# EAGLE schematic main (EAGLE 9.5.2)
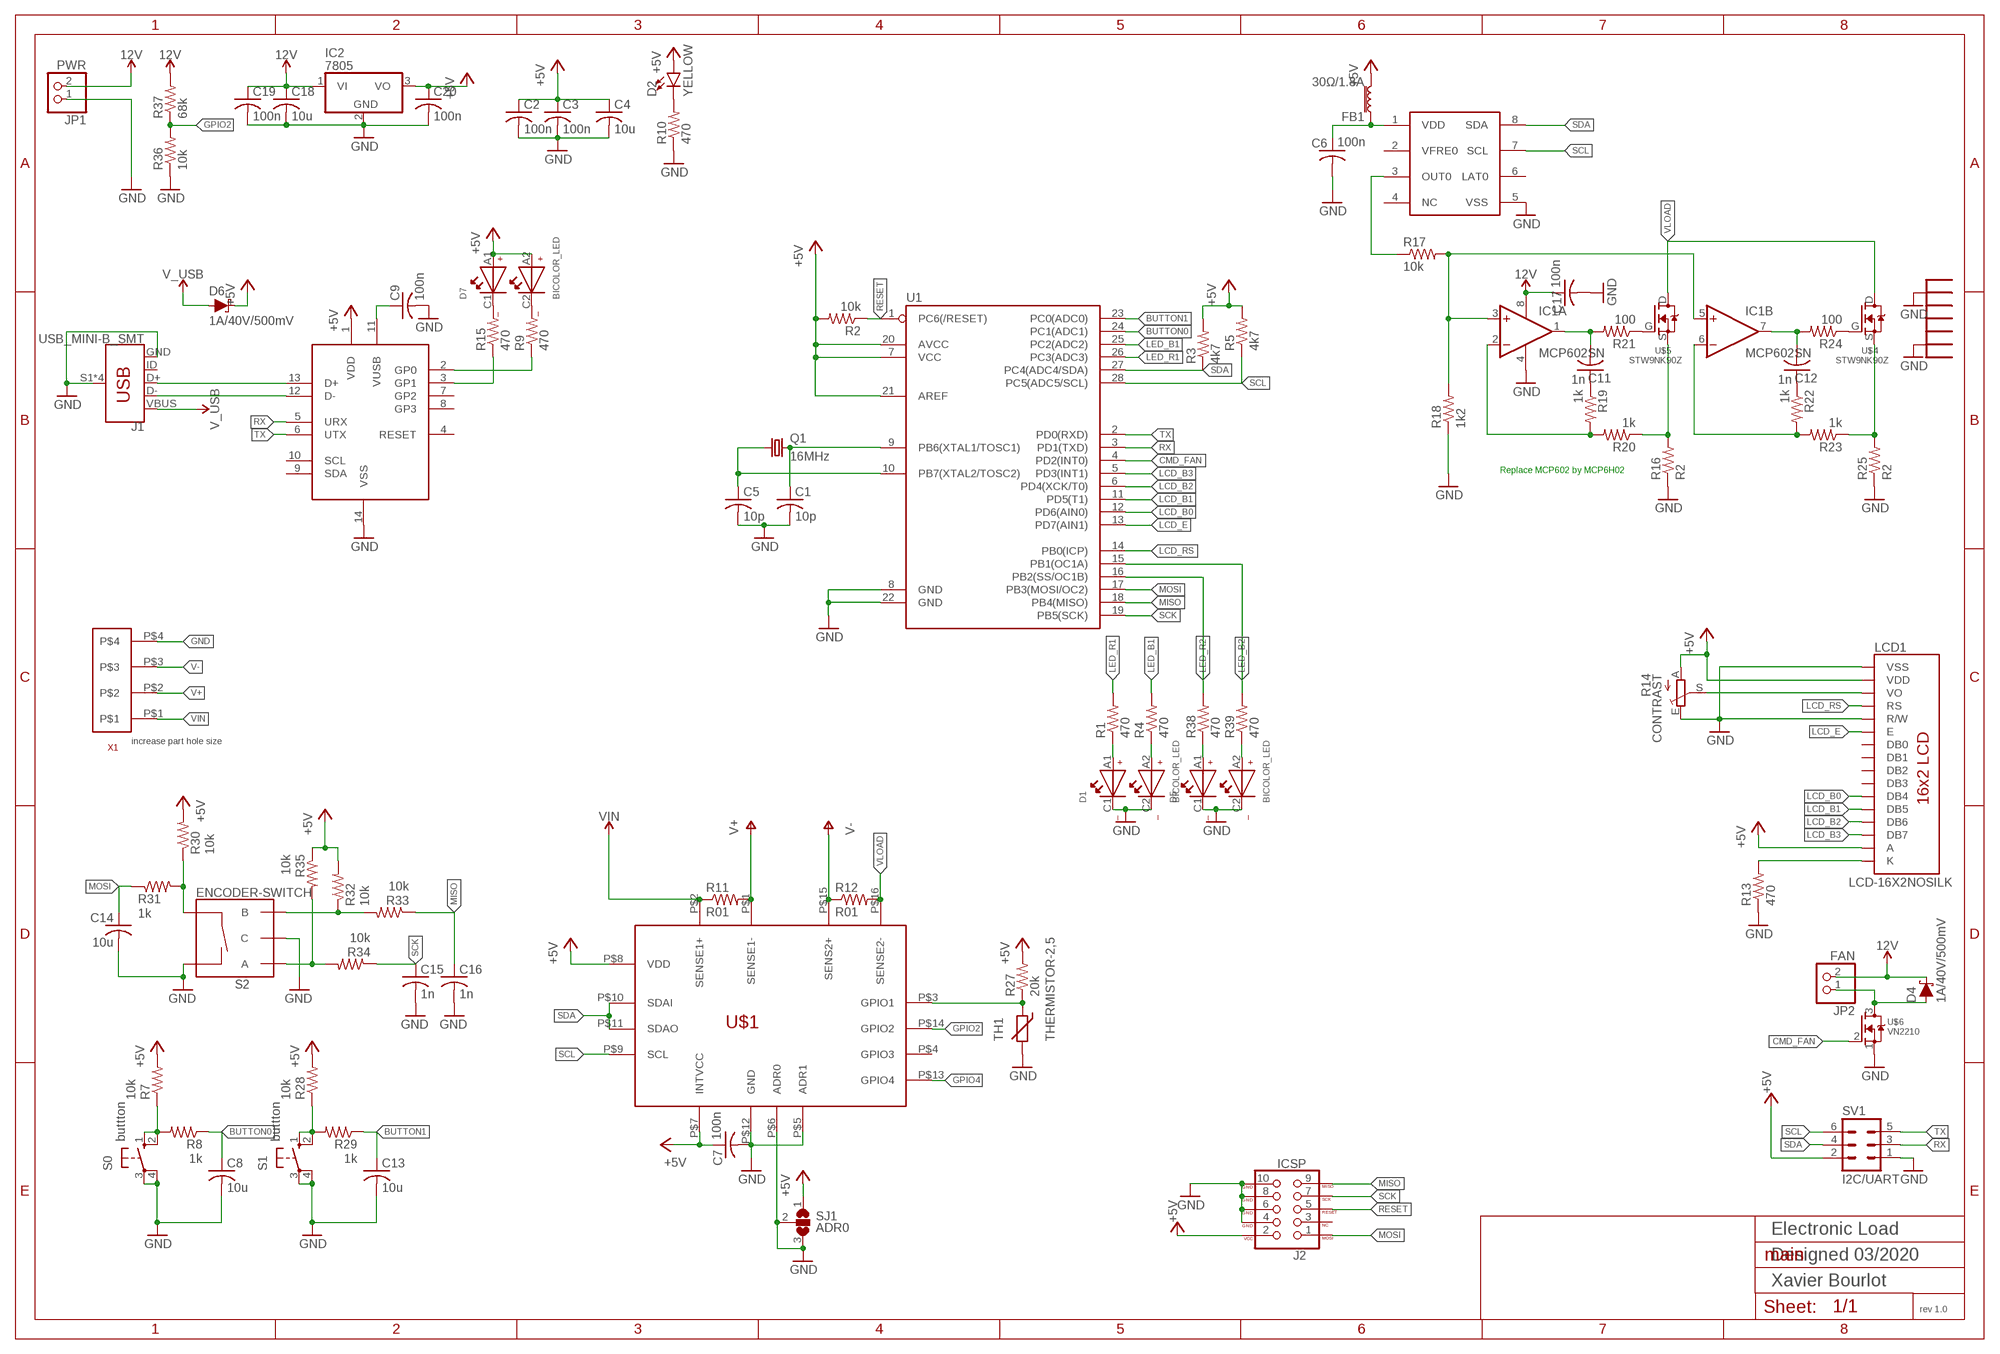
[diagram p0: schematic, sheet 1]

## Parts
BR1  MCP2221A  [DIP14]
C1  10p  C-USC0603  [C0603]
C2  100n  C-USC0603  [C0603]
C3  100n  C-USC0603  [C0603]
C4  10u  C-USC1206  [C1206]
C5  10p  C-USC0603  [C0603]
C6  100n  C-USC0603  [C0603]
C7  100n  C-USC0603  [C0603]
C8  10u  C-USC0603  [C0603]
C9  100n  C-USC0603  [C0603]
C11  1n  C-USC0805  [C0805]
C12  1n  C-USC0805  [C0805]
C13  10u  C-USC0603  [C0603]
C14  10u  C-USC0603  [C0603]
C15  1n  C-USC0603  [C0603]
C16  1n  C-USC0603  [C0603]
C17  100n  C-USC0603  [C0603]
C18  10u  C-USC1206  [C1206]
C19  100n  C-USC0603  [C0603]
C20  100n  C-USC0603  [C0603]
D1  BICOLOR_LED  [BICOLOR_LED]
D2  YELLOW  LED3MM  [LED_3MM]
D4  1A/40V/500mV  DIODE-SCHOTTKY-SS14  [SMA-DIODE]
D5  BICOLOR_LED  [BICOLOR_LED]
D6  1A/40V/500mV  DIODE-SCHOTTKY-SS14  [SMA-DIODE]
D7  BICOLOR_LED  [BICOLOR_LED]
FB1  30Ω/1.8A  FERRITE_BEAD-0603  [0603]
IC1  MCP602SN  [SO08]
IC2  7805  786TV  [TO220V]
J1  USB_MINI-B_SMT  [USB-MINIB]
J2  ICSP  AVR_SPI_PROG_5X2PTH2  [2X5-SHROUDED]
JP1  PWR  PINHD-1X2  [1X02]
JP2  FAN  PINHD-1X2  [1X02]
LCD1  LCD-16X2NOSILK  [LCD-16X2_NOSILK]
Q1  16MHz  CRYSTALHC49U70  [HC49U70]
R1  470  R-US_R0805  [R0805]
R2  10k  R-US_R0805  [R0805]
R3  4k7  R-US_R0805  [R0805]
R4  470  R-US_R0805  [R0805]
R5  4k7  R-US_R0805  [R0805]
R7  10k  R-US_R0805  [R0805]
R8  1k  R-US_R0805  [R0805]
R9  470  R-US_R0805  [R0805]
R10  470  R-US_R0805  [R0805]
R11  R01  R-US_R2512  [R2512]
R12  R01  R-US_R2512  [R2512]
R13  470  R-US_R0805  [R0805]
R14  CONTRAST  TRIM_EU-RJ9W  [RJ9W]
R15  470  R-US_R0805  [R0805]
R16  R2  R-US_R2512  [R2512]
R17  10k  R-US_R0805  [R0805]
R18  1k2  R-US_R0805  [R0805]
R19  1k  R-US_R0805  [R0805]
R20  1k  R-US_R0805  [R0805]
R21  100  R-US_R0805  [R0805]
R22  1k  R-US_R0805  [R0805]
R23  1k  R-US_R0805  [R0805]
R24  100  R-US_R0805  [R0805]
R25  R2  R-US_R2512  [R2512]
R27  20k  R-US_R0805  [R0805]
R28  10k  R-US_R0805  [R0805]
R29  1k  R-US_R0805  [R0805]
R30  10k  R-US_R0805  [R0805]
R31  1k  R-US_R0805  [R0805]
R32  10k  R-US_R0805  [R0805]
R33  10k  R-US_R0805  [R0805]
R34  10k  R-US_R0805  [R0805]
R35  10k  R-US_R0805  [R0805]
R36  10k  R-US_R0805  [R0805]
R37  68k  R-US_R0805  [R0805]
R38  470  R-US_R0805  [R0805]
R39  470  R-US_R0805  [R0805]
S0  buttton  10-XX  [B3F-10XX]
S1  buttton  10-XX  [B3F-10XX]
S2  ENCODER-SWITCH  [ROTARY_ENC_PLAIN]
SJ1  ADR0  SJ2W  [SJ_2]
SV1  I2C/UART  MA03-2  [MA03-2]
TH1  THERMISTOR-2,5  [RS-2,5]
U1  328P  ATMEGA328P_PDIP  [DIP28]
U$1  LTC2992  [MSOP16]
U$2  HEATSINK_0NOSILK  [HEATSINK_01]
U$3  MCP47FEB21  [TSSOP8]
U$4  STW9NK90Z  [TO247BV]
U$5  STW9NK90Z  [TO247BV]
U$6  VN2210  [TO92]
X1  SCREWTERM_5MM_4WAY  [SCREWTERM_5MM_4WAY]

## Nets
12V: C17.1 C18.1 C19.1 D4.C IC1.8(P:V+) IC2.1(VI) JP1.2 JP2.2 R37.2
+5V: BR1.1(VDD) C2.1 C3.1 C4.1 C7.1 C20.1 D2.A D6.C D7.A1 D7.A2 FB1.2 IC2.3(VO) J2.2(VCC) LCD1.2(VDD) LCD1.15(A) R2.2 R3.2 R5.2 R7.2 R14.A R27.2 R28.2 R30.2 R32.2 R35.1 SJ1.1 SV1.2 U1.7(VCC) U1.20(AVCC) U1.21(AREF) U$1.P$7(INTVCC) U$1.P$8(VDD)
B0: R7.1 R8.2 S0.1(S) S0.2(S1)
B1: R28.1 R29.2 S1.1(S) S1.2(S1)
BUTTON0: C8.1 R8.1 U1.24(PC1(ADC1))
BUTTON1: C13.1 R29.1 U1.23(PC0(ADC0))
CMD_FAN: U1.4(PD2(INT0)) U$6.2(G)
D+: BR1.13(D+) J1.D+
D-: BR1.12(D-) J1.D-
DAC_OUT: R17.1 U$3.3(OUT0)
FANNEG: D4.A JP2.1 U$6.3(D)
GND: BR1.14(VSS) C1.2 C2.2 C3.2 C4.2 C5.2 C6.2 C7.2 C8.2 C9.2 C13.2 C14.2 C15.2 C16.2 C17.2 C18.2 C19.2 C20.2 D1.C1 D1.C2 D5.C1 D5.C2 IC1.4(P:V-) IC2.2(GND) J1.GND J1.S1(SHIELD) J1.S2(SHIELD) J1.S3(SHIELD) J1.S4(SHIELD) J2.4(GND) J2.6(GND) J2.8(GND) J2.10(GND) JP1.1 LCD1.1(VSS) LCD1.5(R/W) R10.1 R13.1 R14.E R16.1 R18.1 R25.1 R36.1 S0.3(P) S0.4(P1) S1.3(P) S1.4(P1) S2.C S2.SW- SJ1.2 SJ1.3 SV1.1 TH1.2 U1.8(GND) U1.22(GND) U$1.P$5(ADR1) U$1.P$6(ADR0) U$1.P$12(GND) U$2.P$1 U$2.P$2 U$3.5(VSS) U$6.1(S) X1.P$4
GPIO2: R36.2 R37.1 U$1.P$14(GPIO2)
GPIO4: U$1.P$13(GPIO4)
LCD1_CONTRAST: LCD1.3(VO) R14.S
LCD1_K: LCD1.16(K) R13.2
LCD_B0: LCD1.11(DB4) U1.12(PD6(AIN0))
LCD_B1: LCD1.12(DB5) U1.11(PD5(T1))
LCD_B2: LCD1.13(DB6) U1.6(PD4(XCK/T0))
LCD_B3: LCD1.14(DB7) U1.5(PD3(INT1))
LCD_E: LCD1.6(E) U1.13(PD7(AIN1))
LCD_RS: LCD1.4(RS) U1.14(PB0(ICP))
LED_B1: R4.2 U1.25(PC2(ADC2))
LED_B2: R39.2 U1.15(PB1(OC1A))
LED_R1: R1.2 U1.26(PC3(ADC3))
LED_R2: R38.2 U1.16(PB2(SS/OC1B))
MISO: C16.1 J2.9(MISO) R33.1 U1.18(PB4(MISO))
MOSI: C14.1 J2.1(MOSI) R31.1 U1.17(PB3(MOSI/OC2))
N$1: C1.1 Q1.2 U1.9(PB6(XTAL1/TOSC1))
N$2: C5.1 Q1.1 U1.10(PB7(XTAL2/TOSC2))
N$3: C6.1 FB1.1 U$3.1(VDD)
N$4: D5.A1 R38.1
N$5: D5.A2 R39.1
N$6: D1.A1 R1.1
N$7: R21.1 U$5.G
N$8: D1.A2 R4.1
N$9: BR1.2(GP0) R9.1
N$10: BR1.11(VUSB) C9.1
N$11: BR1.3(GP1) R15.1
N$12: D7.C1 R15.2
N$13: D7.C2 R9.2
N$14: D2.K(C) R10.2
N$20: C11.1 R19.1
N$23: C12.1 R22.1
RESET: J2.5(RESET) R2.1 U1.1(PC6(/RESET))
RX: BR1.5(URX) SV1.3 U1.3(PD1(TXD))
SCK: C15.1 J2.7(SCK) R34.1 U1.19(PB5(SCK))
SCL: R5.1 SV1.6 U1.28(PC5(ADC5/SCL)) U$1.P$9(SCL) U$3.7(SCL)
SDA: R3.1 SV1.4 U1.27(PC4(ADC4/SDA)) U$1.P$10(SDAI) U$1.P$11(SDAO) U$3.8(SDA)
TX: BR1.6(UTX) SV1.5 U1.2(PD0(RXD))
V+: R11.2 U$1.P$1(SENSE1-) X1.P$2
V-: R12.1 U$1.P$15(SENS2+) X1.P$3
V_USB: D6.A J1.VBUS
VCTRL: IC1.3(A:+IN) IC1.5(B:+IN) R17.2 R18.2
VENC: R30.1 R31.2 S2.SW+
VENCA: R34.2 R35.2 S2.A
VENCB: R32.1 R33.2 S2.B
VFB1: IC1.2(A:-IN) R19.2 R20.2
VFB2: IC1.6(B:-IN) R22.2 R23.2
VG2: R24.1 U$4.G
VIN: R11.1 U$1.P$2(SENSE1+) X1.P$1
VLOAD: R12.2 U$1.P$16(SENSE2-) U$4.D U$5.D
VO1: C11.2 IC1.1(A:OUT) R21.2
VO2: C12.2 IC1.7(B:OUT) R24.2
VS1: R16.2 R20.1 U$5.S
VS2: R23.1 R25.2 U$4.S
VT: R27.1 TH1.1 U$1.P$3(GPIO1)
Unconnected: BR1.4(RESET) BR1.7(GP2) BR1.8(GP3) BR1.9(SDA) BR1.10(SCL) J1.ID J2.3(NC) LCD1.7(DB0) LCD1.8(DB1) LCD1.9(DB2) LCD1.10(DB3) U$1.P$4(GPIO3) U$3.2(VFRE0) U$3.4(NC) U$3.6(LAT0)

## Notes on the sheet
- Replace MCP602 by MCP6H02
- increase part hole size
- Electronic Load
- Designed 03/2020
- Xavier Bourlot
- rev 1.0

## Library data of the parts
BR1 = 7_segment_lib:MCP2221A
C1-C9 C11-C20 = rcl:C-US: CAPACITOR, American symbol; SPICEPREFIX: C
D1 D5 D7 = 7_segment_lib:BICOLOR_LED
D2 = SparkFun-LED:LED: LED (Generic) Standard schematic elements and footprints for 5mm, 3mm, 1206, and 0603 sized LEDs. Generic LEDs with no color specified.; PROD_ID: DIO-08794
D4 D6 = SparkFun-DiscreteSemi:DIODE-SCHOTTKY: Schottky diode A Schottky diode is a semiconductor diode which has a low forward voltage drop and a very fast switching action.; PROD_ID: DIO-08053
FB1 = SparkFun-Coils:FERRITE_BEAD: Ferrite Bead (blocks, cores, rings, chokes, etc.) Inductor with layers of ferrite used to suppress high frequencies. Often used to isolate high frequency noise. SparkFun Products: IOIO-OTG - V2.2 <https://www.sparkfun.com/products/13613> SparkFun SAMD21 Mini Breakout <https://www.sparkfun.com/products/13664> SparkFun 6 Degrees of Freedom Breakout - LSM6DS3 <https://www.sparkfun.com/products/13339> SparkFun SAMD21 Dev Breakout <https://www.sparkfun.com/products/13672>; PROD_ID: NDUC-07859
IC1 = linear:MCP602: Single Op Amp 2.7V to 6.0V Single Supply CMOS Source: http://ww1.microchip.com/downloads/en/DeviceDoc/21314g.pdf
IC2 = linear:78*: Positive VOLTAGE REGULATOR Source: http://cache.national.com/ds/LM/LM78L05.pdf http://www.fairchildsemi.com/ds/LM/LM7805.pdf
J1 = SparkFun-Connectors:USB_MINI-B: USB type Mini-B Connector Breaks out 5th pin, and includes shield pins if needed. SparkFun Products: SparkFun FTDI Basic Breakout <https://www.sparkfun.com/products/9716> SparkFun XBee Explorer USB <https://www.sparkfun.com/products/11812> SparkFun Redboard <https://www.sparkfun.com/products/12757>; PROD_ID: CONN-08193; SF_ID: PRT-00587
J2 = SparkFun-Connectors:AVR_SPI_PROG_5X2: AVR 10-pin ICSP Header This is the standard AVR In Circuit Serial Programming header. Minimal, but includes pin one indicator. Works with standard Olimex programmers. SparkFun Products: 2x5 AVR ICSP Male Header <https://www.sparkfun.com/products/778> - PTH 2x5 Pin Shrouded Header <https://www.sparkfun.com/products/8506> - PTH2; PROD_ID: CONN-08671; SF_ID: PRT-08506
JP1 JP2 = pinhead:PINHD-1X2: PIN HEADER
LCD1 = 7_segment_lib:LCD-16X2: Standard text-only 16x2 parallel input LCD Basic 16 character by 2 line display. Typically utilizes the extremely common HD44780 parallel interface chipset SparkFun Products: Basic 16x2 Green <https://www.sparkfun.com/products/255> Basic 8x2 Green <https://www.sparkfun.com/products/11122>; SF_ID: LCD-00255
Q1 = crystal:CRYSTAL: CRYSTAL; OC_FARNELL: unknown; OC_NEWARK: unknown
R1-R5 R7-R13 R15-R25 R27-R39 = rcl:R-US_: RESISTOR, American symbol; SPICEPREFIX: R
R14 = pot:TRIM_EU-: POTENTIOMETER
S0 S1 = DC_LOAD_AU:10-XX: OMRON SWITCH; MPN: B3F-1000; OC_FARNELL: 176432; OC_NEWARK: 36M3542
S2 = SparkFun-Switches:ENCODER-SWITCH: Rotary Encoder w/ Select Switch Encoders rotate similarly to potentiometers, but they’re different from potentiometers in that an encoder has full rotation without limits. They output gray code so that you can tell how much and in which direction the encoder has been turned. This encoder includes a push-down select switch built into the shaft. SparkFun Products Rotary Encoder <https://www.sparkfun.com/products/9117> (COM-09117); SF_SKU: COM-09117
SJ1 = jumper:SJ2W: SMD solder JUMPER
SV1 = con-lstb:MA03-2: PIN HEADER; OC_FARNELL: unknown; OC_NEWARK: unknown
TH1 = varistor:THERMISTOR: THERMISTOR
U1 = 7_segment_lib:ATMEGA328P_PDIP: Atmel 328P Through hole ATMEGA328P uC used in the Arduino 32kb flash, 1k EEPROM, 2k SRAM Datasheet <http://www.sparkfun.com/datasheets/Components/SMD/ATMega328.pdf> SparkFun Products Storefront component: AVR 28 Pin 20MHz 32K 6A/D - ATMega328P <https://www.sparkfun.com/products/9061> (COM-09061) SparkFun Simon Says - Through-Hole Soldering Kit <https://www.sparkfun.com/products/10547> (KIT-10547) SparkFun Learn to Solder - Simon Says <https://www.sparkfun.com/products/13708> (KIT-13708) SparkFun BigTime Watch Kit <https://www.sparkfun.com/products/11734> (KIT-11734) SparkFun ClockIt <https://www.sparkfun.com/products/10930> (KIT-10930) SparkFun Serial Enabled LCD Kit <https://www.sparkfun.com/products/10097> (LCD-10097) SparkFun Simon Tilts - Through Hole Soldering Kit <https://www.sparkfun.com/products/12634> (KIT-12634) SparkFun Frequency Counter Kit <https://www.sparkfun.com/products/10140> (KIT-10140) FabFM Radio Kit <https://www.sparkfun.com/products/11043> (KIT-11043) SparkFun Binary Blaster Kit <https://www.sparkfun.com/products/12037> (KIT-12037) SparkFun Metro-Gnome <https://www.sparkfun.com/products/9236> (KIT-09236) ATmega328 with Arduino Optiboot (Uno) <https://www.sparkfun.com/products/10524> (DEV-10524); PROD_ID: IC-09136
U$1 = 7_segment_lib:LTC2992
U$2 = 7_segment_lib:HEATSINK_0
U$3 = 7_segment_lib:MCP47FEB21
U$4 U$5 = 7_segment_lib:STW9NK90Z
U$6 = 7_segment_lib:VN2210
X1 = 7_segment_lib:SCREWTERM_5MM_4WAY